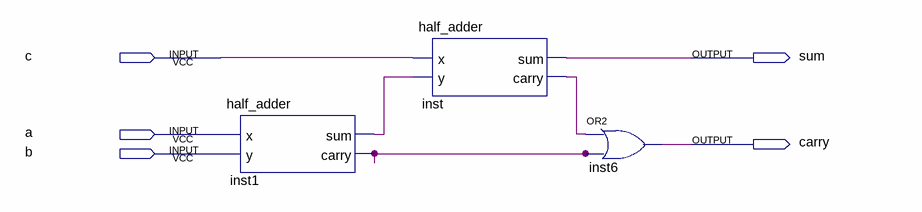
[diagram p0: schematic sheet]
// Quartus schematic full_adder_sch.bdf as structural Verilog: 3 symbols, 5 pins
module full_adder_sch (
  input  c,
  input  a,
  input  b,
  output sum,
  output carry
);

  wire inst1_carry, inst1_sum, inst_carry;

  half_adder inst1 (.x(a), .y(b), .sum(inst1_sum), .carry(inst1_carry));
  half_adder inst (.x(c), .y(inst1_sum), .sum(sum), .carry(inst_carry));
  or inst6 (carry, inst_carry, inst1_carry);
endmodule
